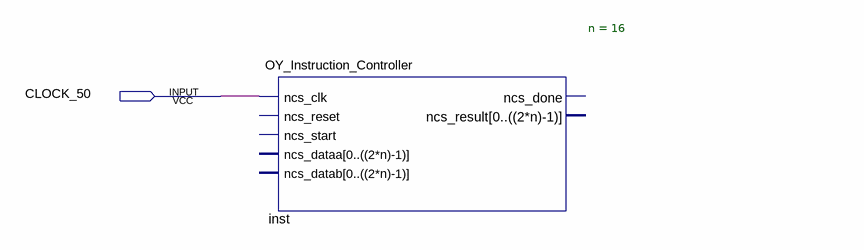
[diagram p0: schematic sheet]
// Quartus schematic OY_Instruction_Controller.bdf as structural Verilog: 1 symbols, 1 pins
module OY_Instruction_Controller (
  input  CLOCK_50
);

  OY_Instruction_Controller #(.n(16)) inst (.ncs_clk(CLOCK_50));  // open: ncs_reset, ncs_start, ncs_dataa, ncs_datab, ncs_done, ncs_result
endmodule
